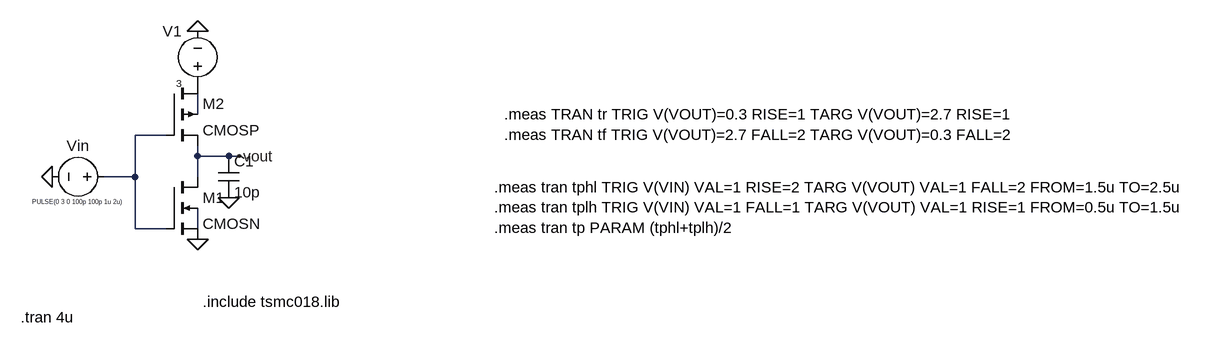
[diagram p0: schematic Draft1.asc]
Draft1.asc, the LTspice schematic file:
Version 4
SHEET 1 1612 680
WIRE 32 -240 32 -272
WIRE -16 -208 -64 -208
WIRE 32 -176 32 -192
WIRE 80 -176 32 -176
WIRE 96 -176 80 -176
WIRE -64 -144 -64 -208
WIRE -64 -144 -112 -144
WIRE 32 -144 32 -176
WIRE -64 -64 -64 -144
WIRE -16 -64 -64 -64
WIRE 32 -64 32 -96
FLAG -192 -144 0
FLAG 32 -368 0
FLAG 32 -48 0
FLAG 96 -176 vout
FLAG 80 -112 0
SYMBOL cmosn -16 -144 R0
SYMATTR InstName M1
SYMATTR Value2 l=0.18u w=1u
SYMBOL cmosp -16 -288 R0
SYMATTR InstName M2
SYMATTR Value2 l=0.18u w=2.1u
SYMBOL voltage -96 -144 M270
WINDOW 0 32 56 VTop 2
WINDOW 3 -32 56 VBottom 0
WINDOW 123 0 0 Left 0
WINDOW 39 0 0 Left 0
SYMATTR InstName Vin
SYMATTR Value PULSE(0 3 0 100p 100p 1u 2u)
SYMBOL voltage 32 -272 R180
WINDOW 0 24 96 Left 2
WINDOW 3 24 16 Left 1
WINDOW 123 0 0 Left 0
WINDOW 39 0 0 Left 0
SYMATTR InstName V1
SYMATTR Value 3
SYMBOL cap 64 -176 R0
SYMATTR InstName C1
SYMATTR Value 10p
TEXT 40 48 Left 2 !.include tsmc018.lib
TEXT -240 72 Left 2 !.tran 4u
TEXT 504 -240 Left 2 !.meas TRAN tr TRIG V(VOUT)=0.3 RISE=1 TARG V(VOUT)=2.7 RISE=1\n.meas TRAN tf TRIG V(VOUT)=2.7 FALL=2 TARG V(VOUT)=0.3 FALL=2
TEXT 488 -128 Left 2 !.meas tran tphl TRIG V(VIN) VAL=1 RISE=2 TARG V(VOUT) VAL=1 FALL=2 FROM=1.5u TO=2.5u\n.meas tran tplh TRIG V(VIN) VAL=1 FALL=1 TARG V(VOUT) VAL=1 RISE=1 FROM=0.5u TO=1.5u\n.meas tran tp PARAM (tphl+tplh)/2

The netlist it stands for:
* Draft1.asc
M1 vout N002 0 N003 CMOSN l=0.18u w=1u
M2 P001 N002 vout N001 CMOSP l=0.18u w=2.1u
Vin N002 0 PULSE(0 3 0 100p 100p 1u 2u)
V1 P001 0 3
C1 vout 0 10p
.model NMOS NMOS
.model PMOS PMOS
.lib standard.mos
.include tsmc018.lib
.tran 4u
.meas TRAN tr TRIG V(VOUT)=0.3 RISE=1 TARG V(VOUT)=2.7 RISE=1
.meas TRAN tf TRIG V(VOUT)=2.7 FALL=2 TARG V(VOUT)=0.3 FALL=2
.meas tran tphl TRIG V(VIN) VAL=1 RISE=2 TARG V(VOUT) VAL=1 FALL=2 FROM=1.5u TO=2.5u
.meas tran tplh TRIG V(VIN) VAL=1 FALL=1 TARG V(VOUT) VAL=1 RISE=1 FROM=0.5u TO=1.5u
.meas tran tp PARAM (tphl+tplh)/2
.backanno
.end